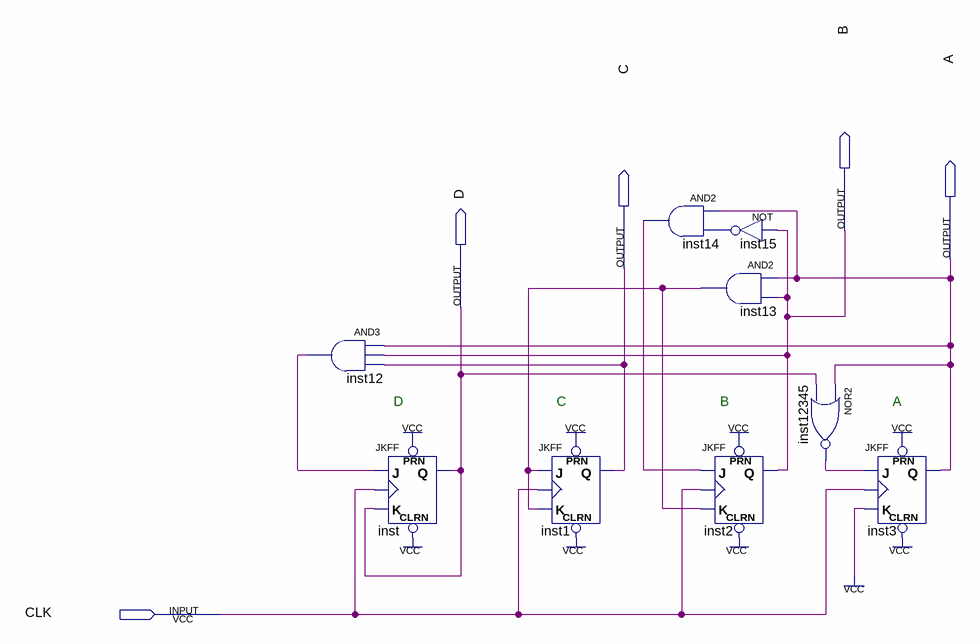
[diagram p0: schematic sheet]
// Quartus schematic mod9Counter.bdf as structural Verilog: 9 symbols, 5 pins
module mod9Counter (
  input  CLK,
  output B,
  output A,
  output C,
  output D
);

  wire inst12_out, inst13_out, inst14_out, inst15_out, inst12345_out;

  and inst12 (inst12_out, A, B, C);
  JKFF inst (.PRN(1'b1), .CLRN(1'b1), .K(D), .J(inst12_out), .CLK(CLK), .Q(D));
  JKFF inst1 (.PRN(1'b1), .CLRN(1'b1), .K(inst13_out), .J(inst13_out), .CLK(CLK), .Q(C));
  and inst14 (inst14_out, A, inst15_out);
  not inst15 (inst15_out, B);
  and inst13 (inst13_out, A, B);
  JKFF inst2 (.PRN(1'b1), .CLRN(1'b1), .K(inst13_out), .J(inst14_out), .CLK(CLK), .Q(B));
  nor inst12345 (inst12345_out, A, D);
  JKFF inst3 (.PRN(1'b1), .CLRN(1'b1), .K(1'b1), .J(inst12345_out), .CLK(CLK), .Q(A));

  // Notes on the sheet:
  //   D
  //   C
  //   B
  //   A
endmodule
